# EAGLE design RatRig - EVA - Board (EAGLE 9.6.2)
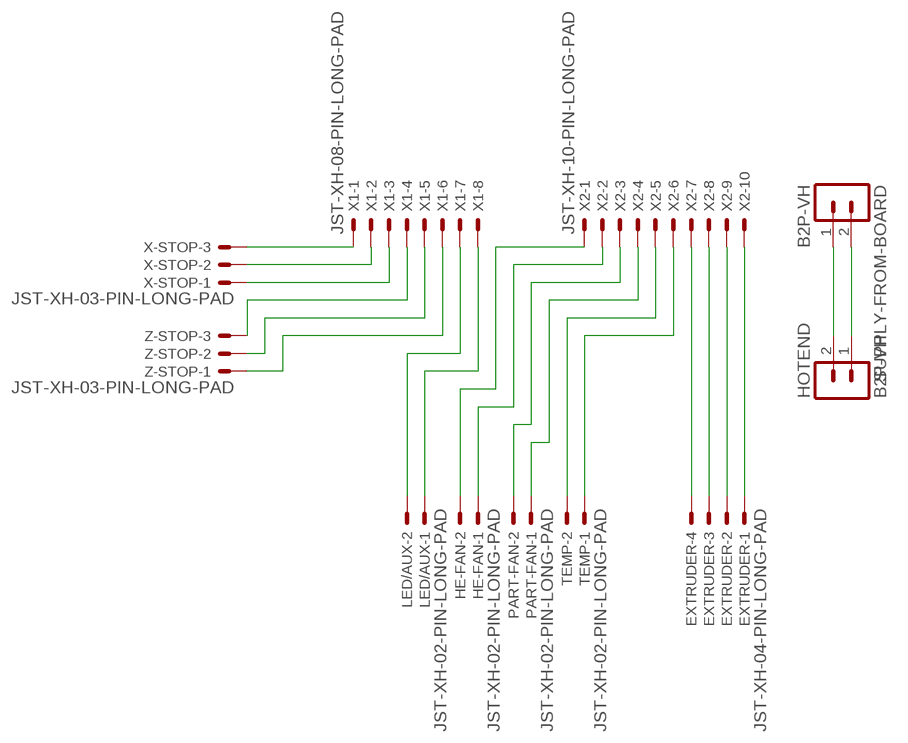
[diagram p0: schematic, sheet 1]

## Parts
EXTRUDER  JST-XH-04-PIN-LONG-PAD  [JST-XH-04-PACKAGE-LONG-PAD]
HE-FAN  JST-XH-02-PIN-LONG-PAD  [JST-XH-02-PACKAGE-LONG-PAD]
HOTEND  B2P-VH  [B2P-VH]
LED/AUX  JST-XH-02-PIN-LONG-PAD  [JST-XH-02-PACKAGE-LONG-PAD]
PART-FAN  JST-XH-02-PIN-LONG-PAD  [JST-XH-02-PACKAGE-LONG-PAD]
SUPPLY-FROM-BOARD  B2P-VH  [B2P-VH]
TEMP  JST-XH-02-PIN-LONG-PAD  [JST-XH-02-PACKAGE-LONG-PAD]
X1  JST-XH-08-PIN-LONG-PAD  [JST-XH-08-PACKAGE-LONG-PAD]
X2  JST-XH-10-PIN-LONG-PAD  [JST-XH-10-PACKAGE-LONG-PAD]
X-STOP  JST-XH-03-PIN-LONG-PAD  [JST-XH-03-PACKAGE-LONG-PAD]
Z-STOP  JST-XH-03-PIN-LONG-PAD  [JST-XH-03-PACKAGE-LONG-PAD]

## Nets
HE-FAN-GND [Fan]: HE-FAN.1 X2.2
HE-FAN-VCC [Fan]: HE-FAN.2 X2.1
HE-GND [HotEnd]: HOTEND.1 SUPPLY-FROM-BOARD.2
HE-VCC [HotEnd]: HOTEND.2 SUPPLY-FROM-BOARD.1
LED-5V [LED]: LED/AUX.2 X1.7
LED-GND [LED]: LED/AUX.1 X1.8
MOTOR-1 [Motor]: EXTRUDER.4 X2.7
MOTOR-2 [Motor]: EXTRUDER.3 X2.8
MOTOR-3 [Motor]: EXTRUDER.2 X2.9
MOTOR-4 [Motor]: EXTRUDER.1 X2.10
PART-FAN-GND [Fan]: PART-FAN.1 X2.4
PART-FAN-VCC [Fan]: PART-FAN.2 X2.3
TEMP-P1: TEMP.2 X2.5
TEMP-P2: TEMP.1 X2.6
X-5V: X1.3 X-STOP.1
X-GND: X1.2 X-STOP.2
X-SIG: X1.1 X-STOP.3
Z-5V: X1.6 Z-STOP.1
Z-GND: X1.5 Z-STOP.2
Z-SIG: X1.4 Z-STOP.3

## Library data of the parts
EXTRUDER = Rembrandt Electronics - JST XH Connectors v1-0:JST-XH-04-PIN: JST XH Connector 2 Pin Wire to board connector. Pitch: 2,54 mm, (0.100") Number of pins: 4 Created by Rembrandt Electronics www.rembrandtelectronics.com
HE-FAN LED/AUX PART-FAN TEMP = Rembrandt Electronics - JST XH Connectors v1-0:JST-XH-02-PIN: JST XH Connector 2 Pin Wire to board connector. Pitch: 2,54 mm, (0.100") Number of pins: 2 Created by Rembrandt Electronics www.rembrandtelectronics.com
HOTEND SUPPLY-FROM-BOARD = con-JST VH:B2P-VH: JST VH Series header 3.96mm pitch disconnectable crimp style connectors, vertical (side entry type), 2 pins
X1 = Rembrandt Electronics - JST XH Connectors v1-0:JST-XH-08-PIN: JST XH Connector 2 Pin Wire to board connector. Pitch: 2,54 mm, (0.100") Number of pins: 8 Created by Rembrandt Electronics www.rembrandtelectronics.com
X2 = Rembrandt Electronics - JST XH Connectors v1-0:JST-XH-10-PIN: JST XH Connector 2 Pin Wire to board connector. Pitch: 2,54 mm, (0.100") Number of pins: 10 Created by Rembrandt Electronics www.rembrandtelectronics.com
X-STOP Z-STOP = Rembrandt Electronics - JST XH Connectors v1-0:JST-XH-03-PIN: JST XH Connector 2 Pin Wire to board connector. Pitch: 2,54 mm, (0.100") Number of pins: 3 Created by Rembrandt Electronics www.rembrandtelectronics.com

## Net classes
0 default: width 0.381 mm
1 HotEnd: width 3 mm
2 Motor: width 1 mm
3 LED: width 0.508 mm
4 Fan: width 0.508 mm

## Board
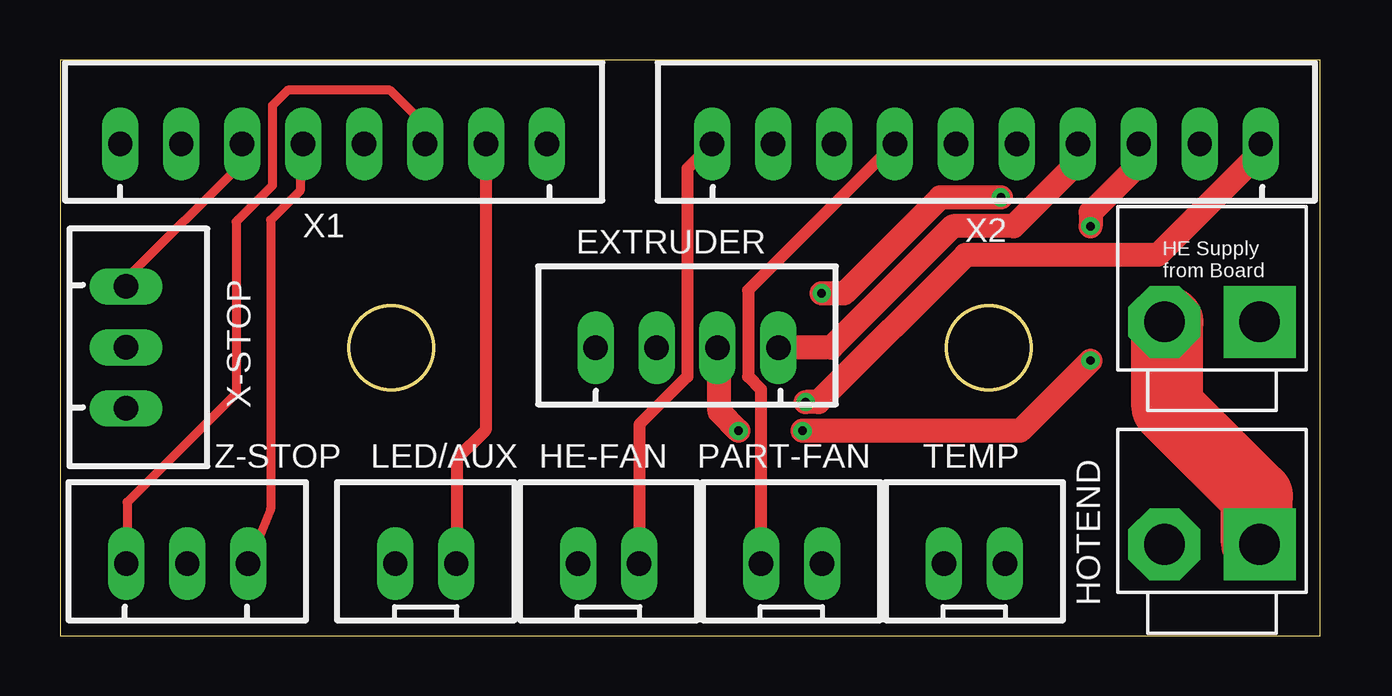
[diagram p1: board, top side]
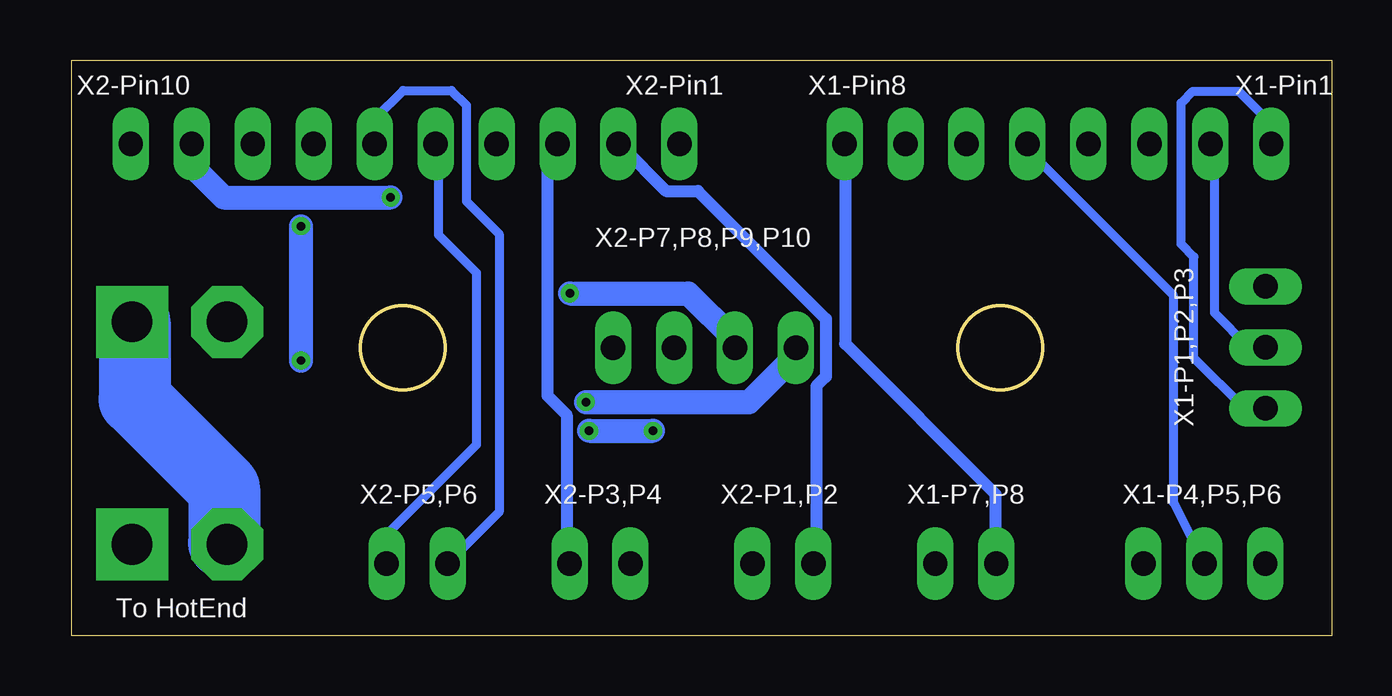
[diagram p2: board, bottom side, seen from below]

Size 52.5 x 24 mm. Coordinates in mm from the lower left corner, seen from the top.
Outline: 0,0 52.5,0 52.5,24 0,24 0,0
Outline: circle at 13.8,12 radius 1.75
Outline: circle at 38.7,12 radius 1.75
Copper layers (1*16): Top 0.035mm / dielectric 1.5mm / Bottom 0.035mm
Design rules "default": minimum track width 6mil, minimum drill 0.35mm, track to track 6mil, track to pad 6mil, pad to pad 6mil, via to via 6mil, smd to smd 6mil, copper to edge 40mil, drill to drill 6mil, minimum pad ring 10mil, minimum via ring 8mil, stop-mask expansion 4mil, vias tented up to drill 0mil, thermal gap 10mil

### Footprints (pad centres in the part's own frame; a part is rotated, then mirrored left to right if it is on the bottom)
JST-XH-04-PACKAGE-LONG-PAD = drill 1.016 long: 1 -3.81,0; 2 -1.27,0; 3 1.27,0; 4 3.81,0
JST-XH-02-PACKAGE-LONG-PAD = drill 1.016 long: 1 -1.27,0; 2 1.27,0
B2P-VH = drill 1.7 pad 3 square: 1 -1.98,0 | drill 1.7 pad 3 octagon: 2 1.98,0
JST-XH-08-PACKAGE-LONG-PAD = drill 1.016 long: 1 -8.89,0; 2 -6.35,0; 3 -3.81,0; 4 -1.27,0; 5 1.27,0; 6 3.81,0; 7 6.35,0; 8 8.89,0
JST-XH-10-PACKAGE-LONG-PAD = drill 1.016 long: 1 -11.43,0; 2 -8.89,0; 3 -6.35,0; 4 -3.81,0; 5 -1.27,0; 6 1.27,0; 7 3.81,0; 8 6.35,0; 9 8.89,0; 10 11.43,0
JST-XH-03-PACKAGE-LONG-PAD = drill 1.016 long: 1 -2.54,0; 2 0,0; 3 2.54,0

### Placement (x,y rotation side)
EXTRUDER  26.12,12 0 top
HE-FAN  22.86,3 0 top
HOTEND  48,3.8 180 top
LED/AUX  15.24,3 0 top
PART-FAN  30.48,3 0 top
SUPPLY-FROM-BOARD  48,13.08 180 top
TEMP  38.1,3 0 top
X1  11.4,20.5 0 top
X2  38.6,20.5 0 top
X-STOP  2.75,12.01 270 top
Z-STOP  5.3,3 0 top

### Tracks (layer width: path | path; a pad name or v marks a point on that pad's centre or on a via)
HE-FAN-GND
  Bottom 0.508: HE-FAN.1 21.47,3.07 21.47,10.4 21.07,10.8 21.07,13.2 26.4,18.54 27.74,18.54 29.6,20.4 X2.2
HE-FAN-VCC
  Top 0.508: HE-FAN.2 24.14,3.07 24.14,8.8 26.14,10.8 26.14,19.47 27.07,20.4 X2.1
HE-GND
  Top 3: SUPPLY-FROM-BOARD.2 46.14,13.07 46.14,9.54 49.87,5.8 49.87,3.87 HOTEND.1
HE-VCC
  Bottom 3: HOTEND.2 46.14,3.87 46.14,6.13 49.87,9.86 49.87,13.07 SUPPLY-FROM-BOARD.1
LED-5V
  Top 0.508: LED/AUX.2 16.54,3.07 16.54,7.36 17.74,8.56 17.74,20.4 X1.7
LED-GND
  Bottom 0.508: LED/AUX.1 14,3.07 14,5.9 20.27,12.17 20.27,20.4 X1.8
MOTOR-1
  Top 1: EXTRUDER.4 30,12 32.14,12 37.2,17.07 39.74,17.07 42.41,19.74 42.41,20.4 X2.7
MOTOR-2  (via drill 0.35)
  Top 1: v28.27,8.53 27.47,9.34 27.47,11.87 EXTRUDER.3 | v30.94,8.53 40.01,8.53 v42.94,11.47 | v42.94,17.07 42.94,17.64 44.94,19.64 44.94,20.4 X2.8
  Bottom 1: v30.94,8.53 v28.27,8.53 | v42.94,17.07 v42.94,11.47
MOTOR-3  (via drill 0.35)
  Top 1: v31.74,14.27 32.67,14.27 36.67,18.27 v39.2,18.27
  Bottom 1: v31.74,14.27 26.8,14.27 24.94,12.4 24.94,12 EXTRUDER.2 | v39.2,18.27 46.16,18.27 47.47,19.58 47.47,20.4 X2.9
MOTOR-4  (via drill 0.35)
  Top 1: v31.07,9.73 31.6,9.73 37.74,15.87 45.74,15.87 50.01,20.14 50.01,20.4 X2.10
  Bottom 1: v31.07,9.73 24.27,9.73 22.4,11.6 22.4,11.87 EXTRUDER.1
PART-FAN-GND
  Top 0.508: PART-FAN.1 29.2,3.07 29.2,10.27 28.67,10.8 28.67,14.4 34.67,20.4 X2.4
PART-FAN-VCC
  Bottom 0.508: PART-FAN.2 31.87,3.07 31.87,9.2 32.67,10 32.67,20 32.27,20.4 X2.3
TEMP-P1
  Bottom 0.381: X2.5 37.2,20.4 37.2,16.7 35.62,15.12 35.62,7.96 39.37,4.21 39.37,4.16 TEMP.2
TEMP-P2
  Bottom 0.381: X2.6 39.87,21.55 38.69,22.73 36.68,22.73 36.05,22.11 36.05,18.11 34.68,16.75 34.68,5.15 TEMP.1
X-5V
  Top 0.381: X1.3 7.59,19.71 2.8,14.92 2.8,14.67 X-STOP.1
X-GND
  Bottom 0.381: X-STOP.2 3.44,12.02 4.88,13.46 4.88,20.36 X1.2
X-SIG
  Bottom 0.381: X-STOP.3 3.62,9.47 5.73,11.58 5.73,15.79 6.27,16.32 6.27,22.2 5.78,22.69 3.87,22.69 2.55,21.38 2.51,21.32 X1.1
Z-5V
  Top 0.381: Z-STOP.1 2.8,3.07 2.8,5.56 7.33,10.09 7.33,17.26 8.85,18.77 8.85,22.1 9.48,22.74 13.76,22.74 14.98,21.51 X1.6
Z-GND
  Bottom 0.381: Z-STOP.2 6.6,5.57 6.6,14.21 12.8,20.4 X1.5
Z-SIG
  Top 0.381: Z-STOP.3 8.78,5.28 8.78,17.32 10,18.55 10,20.4 X1.4

### Text on the board
tNames: HE Supply / from Board
bNames: X1-Pin1 | X1-Pin8 | X2-Pin1 | X2-Pin10 | X2-P7,P8,P9,P10 | X1-P1,P2,P3 | X1-P4,P5,P6 | X1-P7,P8 | X2-P1,P2 | X2-P3,P4 | X2-P5,P6 | To HotEnd